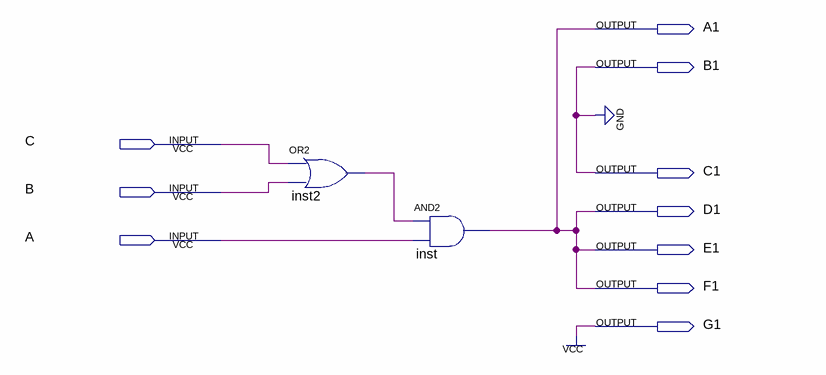
[diagram p0: schematic sheet]
// Quartus schematic display1.bdf as structural Verilog: 2 symbols, 10 pins
module display1 (
  input  C,
  input  B,
  input  A,
  output A1,
  output B1,
  output C1,
  output D1,
  output E1,
  output F1,
  output G1
);

  wire inst2_out;

  or inst2 (inst2_out, C, B);
  and inst (A1, inst2_out, A);

  assign B1 = 1'b0;
  assign C1 = 1'b0;
  assign D1 = A1;
  assign E1 = A1;
  assign F1 = A1;
  assign G1 = 1'b1;
endmodule
